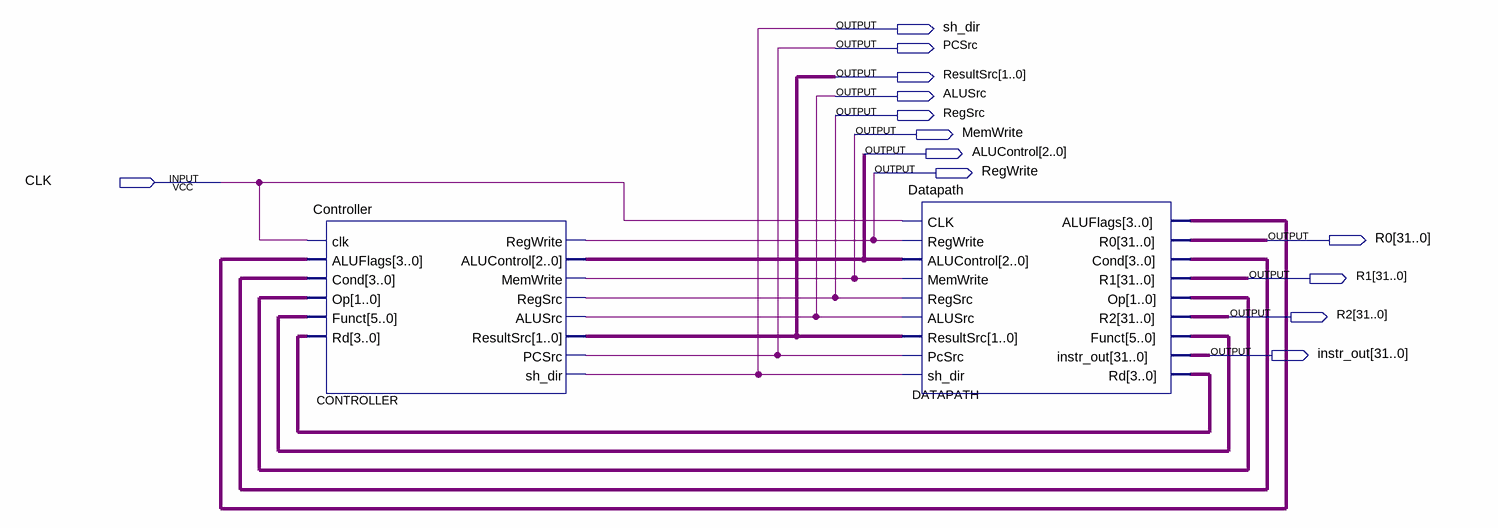
[diagram p0: schematic sheet]
// Quartus schematic Main.bdf as structural Verilog: 2 symbols, 13 pins
module Main (
  input  CLK,
  output sh_dir,
  output PCSrc,
  output [1:0] ResultSrc,
  output ALUSrc,
  output RegSrc,
  output MemWrite,
  output [2:0] ALUControl,
  output RegWrite,
  output [31:0] R0,
  output [31:0] R1,
  output [31:0] R2,
  output [31:0] instr_out
);

  wire [1:0] DATAPATH_op;
  wire [3:0] DATAPATH_aluflags, DATAPATH_cond, DATAPATH_rd;
  wire [5:0] DATAPATH_funct;

  Controller CONTROLLER (
    .clk(CLK), .ALUFlags(DATAPATH_aluflags), .Cond(DATAPATH_cond), .Op(DATAPATH_op), .Funct(DATAPATH_funct),
    .Rd(DATAPATH_rd), .RegWrite(RegWrite), .ALUControl(ALUControl), .MemWrite(MemWrite), .RegSrc(RegSrc),
    .ALUSrc(ALUSrc), .ResultSrc(ResultSrc), .PCSrc(PCSrc), .sh_dir(sh_dir));
  Datapath DATAPATH (
    .CLK(CLK), .RegWrite(RegWrite), .ALUControl(ALUControl), .MemWrite(MemWrite), .RegSrc(RegSrc),
    .ALUSrc(ALUSrc), .ResultSrc(ResultSrc), .PcSrc(PCSrc), .sh_dir(sh_dir), .ALUFlags(DATAPATH_aluflags),
    .R0(R0), .Cond(DATAPATH_cond), .R1(R1), .Op(DATAPATH_op), .R2(R2), .Funct(DATAPATH_funct),
    .instr_out(instr_out), .Rd(DATAPATH_rd));
endmodule
